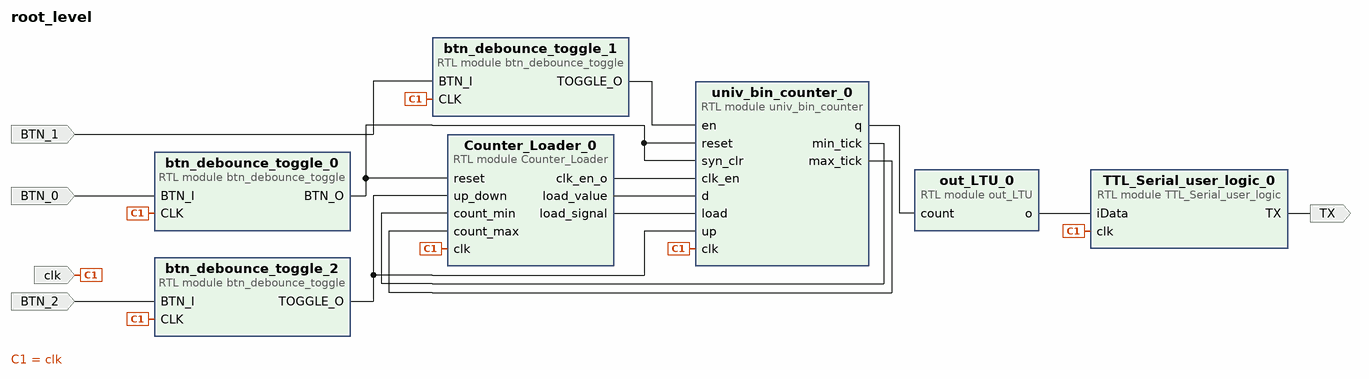
[diagram p0: block diagram of the top level]
# Vivado block design root_level, xc7z010clg225-1, Vivado 2019.1
create_bd_design root_level

create_bd_port -dir I BTN_0
create_bd_port -dir I BTN_1
create_bd_port -dir I BTN_2
create_bd_port -dir O TX
create_bd_port -dir I clk

create_bd_cell -type module -reference btn_debounce_toggle btn_debounce_toggle_0
create_bd_cell -type module -reference btn_debounce_toggle btn_debounce_toggle_1
create_bd_cell -type module -reference btn_debounce_toggle btn_debounce_toggle_2
create_bd_cell -type module -reference out_LTU out_LTU_0
create_bd_cell -type module -reference Counter_Loader Counter_Loader_0
create_bd_cell -type module -reference univ_bin_counter univ_bin_counter_0
create_bd_cell -type module -reference TTL_Serial_user_logic TTL_Serial_user_logic_0

# ---- connections ----

connect_bd_net -net out_LTU_o [get_bd_pins out_LTU_0/o] [get_bd_pins TTL_Serial_user_logic_0/iData]
connect_bd_net -net BTN_0_in [get_bd_ports BTN_0] [get_bd_pins btn_debounce_toggle_0/BTN_I]
connect_bd_net -net BTN_1_in [get_bd_ports BTN_1] [get_bd_pins btn_debounce_toggle_1/BTN_I]
connect_bd_net -net BTN_2_in [get_bd_ports BTN_2] [get_bd_pins btn_debounce_toggle_2/BTN_I]
connect_bd_net [get_bd_ports clk] \
  [get_bd_pins btn_debounce_toggle_2/CLK] [get_bd_pins btn_debounce_toggle_1/CLK] [get_bd_pins btn_debounce_toggle_0/CLK] \
  [get_bd_pins Counter_Loader_0/clk] [get_bd_pins univ_bin_counter_0/clk] [get_bd_pins TTL_Serial_user_logic_0/clk]
connect_bd_net -net clk_en_counter [get_bd_pins Counter_Loader_0/clk_en_o] [get_bd_pins univ_bin_counter_0/clk_en]
connect_bd_net -net Load_value_counter [get_bd_pins Counter_Loader_0/load_value] [get_bd_pins univ_bin_counter_0/d]
connect_bd_net -net load_signal_counter [get_bd_pins Counter_Loader_0/load_signal] [get_bd_pins univ_bin_counter_0/load]
connect_bd_net -net Count_to_LTU [get_bd_pins univ_bin_counter_0/q] [get_bd_pins out_LTU_0/count]
connect_bd_net -net counter_max [get_bd_pins univ_bin_counter_0/min_tick] [get_bd_pins Counter_Loader_0/count_min]
connect_bd_net [get_bd_pins univ_bin_counter_0/max_tick] [get_bd_pins Counter_Loader_0/count_max]
connect_bd_net -net up_down [get_bd_pins btn_debounce_toggle_2/TOGGLE_O] [get_bd_pins Counter_Loader_0/up_down] [get_bd_pins univ_bin_counter_0/up]
connect_bd_net -net counter_enable [get_bd_pins btn_debounce_toggle_1/TOGGLE_O] [get_bd_pins univ_bin_counter_0/en]
connect_bd_net -net System_Initialize [get_bd_pins btn_debounce_toggle_0/BTN_O] \
  [get_bd_pins Counter_Loader_0/reset] [get_bd_pins univ_bin_counter_0/reset] [get_bd_pins univ_bin_counter_0/syn_clr]
connect_bd_net [get_bd_pins TTL_Serial_user_logic_0/TX] [get_bd_ports TX]

validate_bd_design
save_bd_design
